# Altium schematic sheet uart.SchDoc
size A4
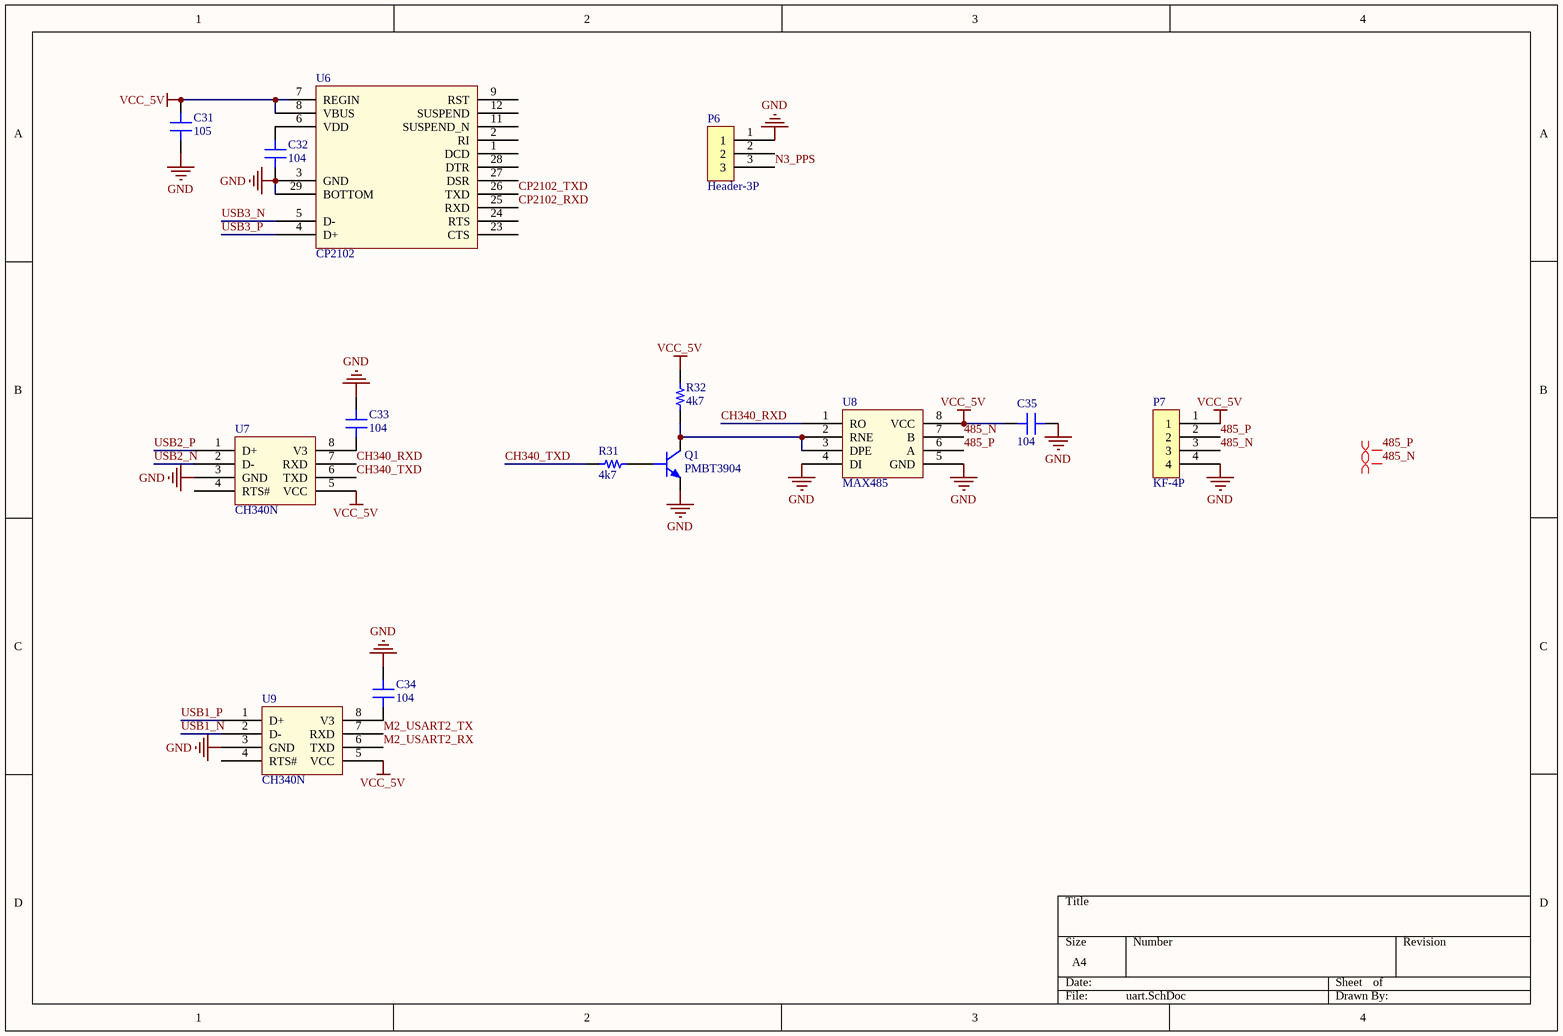
[diagram p0: uart.SchDoc]

## Parts
C31  105  [C0603/1608]
C32  104  [C0603/1608]
C33  104  [C0603/1608]
C34  104  [C0603/1608]
C35  104  [C0603/1608]
P6  Header-3P  [HDR2.54-WI-3P]
P7  KF-4P  [KF3.81-4P（卧式）]
Q1  PMBT3904  [SOT-23-3]
R31  4k7  [R0603/1608]
R32  4k7  [R0603/1608]
U6  CP2102  [QFN50P500X500-28VAM]
U7  CH340N  [SOP-8]
U8  MAX485  [SOP-8]
U9  CH340N  [SOP-8]

## Nets
GND: C31.1 C32.1 C33.2 C34.2 C35.1 P6.1 P7.4 Q1.2(E) U6.3(GND) U6.29(BOTTOM) U7.3(GND) U8.4(DI) U8.5(GND) U9.3(GND)
VCC_5V: C31.2 C35.2 P7.1 R32.1 U6.7(REGIN) U6.8(VBUS) U7.5(VCC) U8.8(VCC) U9.5(VCC)
485_N: P7.3 U8.7(B)
485_P: P7.2 U8.6(A)
CH340_RXD: U7.7(RXD) U8.1(RO)
CH340_TXD: R31.1 U7.6(TXD)
CP2102_RXD: U6.25(RXD)
CP2102_TXD: U6.26(TXD)
M2_USART2_RX: U9.6(TXD)
M2_USART2_TX: U9.7(RXD)
N3_PPS: P6.3
USB1_N: U9.2(D-)
USB1_P: U9.1(D+)
USB2_N: U7.2(D-)
USB2_P: U7.1(D+)
USB3_N: U6.5(D-)
USB3_P: U6.4(D+)
NetC32_2: C32.2 U6.6(VDD)
NetC33_1: C33.1 U7.8(V3)
NetC34_1: C34.1 U9.8(V3)
NetQ1_1: Q1.1(B) R31.2
NetQ1_3: Q1.3(C) R32.2 U8.2(RNE) U8.3(DPE)

Not connected (* = marked no-connect by the designer): P6 2; U6 1(DCD) 2(RI) 9(RST) 11(SUSPEND_N) 12(SUSPEND) 23(CTS) 24(RTS) 27(DSR) 28(DTR); U7 4(RTS#); U9 4(RTS#)

## Layout directives
differential pair: (no net found under the mark)

## Notes on the sheet
- Labels drawn without touching a wire or pin: 485_N, 485_P

## Library data of the parts
C31-C35 = 陶瓷电容
Q1 = NPN: NPN三极管; Published: 8-Jun-2000; LatestRevisionDate: 29-May-2009; LatestRevisionNote: IPC-7351 Footprint Added.; PackageVersion: Aug-1999; PackageReference: SOT-23B; Publisher: Altium Limited; PackageDescription: 3-Pin SOT-23 Package 0.95 mm Pitch, 2.4 mm Lead Span
R31 R32 = 电阻
U7 U9 = CH340N: USB-TTL转换芯片